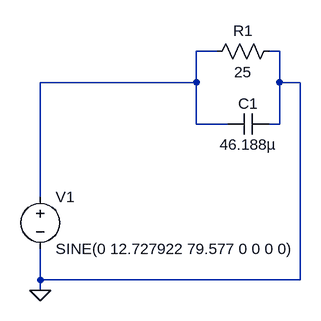
[diagram p0: schematic scheme7.asc]
scheme7.asc, the LTspice schematic file:
Version 4
SHEET 1 880 680
WIRE 608 64 576 64
WIRE 704 64 688 64
WIRE 576 112 576 64
WIRE 576 112 336 112
WIRE 704 112 704 64
WIRE 736 112 704 112
WIRE 576 176 576 112
WIRE 624 176 576 176
WIRE 704 176 704 112
WIRE 704 176 688 176
WIRE 336 288 336 112
WIRE 336 416 336 368
WIRE 736 416 736 112
WIRE 736 416 336 416
WIRE 336 432 336 416
FLAG 336 432 0
SYMBOL voltage 336 272 R0
WINDOW 123 0 0 Left 0
WINDOW 39 0 0 Left 0
SYMATTR InstName V1
SYMATTR Value SINE(0 12.727922 79.577 0 0 0 0)
SYMBOL cap 688 160 R90
WINDOW 0 0 32 VBottom 2
WINDOW 3 32 32 VTop 2
SYMATTR InstName C1
SYMATTR Value 46.188µ
SYMBOL res 704 48 R90
WINDOW 0 0 56 VBottom 2
WINDOW 3 32 56 VTop 2
SYMATTR InstName R1
SYMATTR Value 25

The netlist it stands for:
* scheme7.asc
V1 N001 0 SINE(0 12.727922 79.577 0 0 0 0)
C1 0 N001 46.188µ
R1 0 N001 25
.backanno
.end